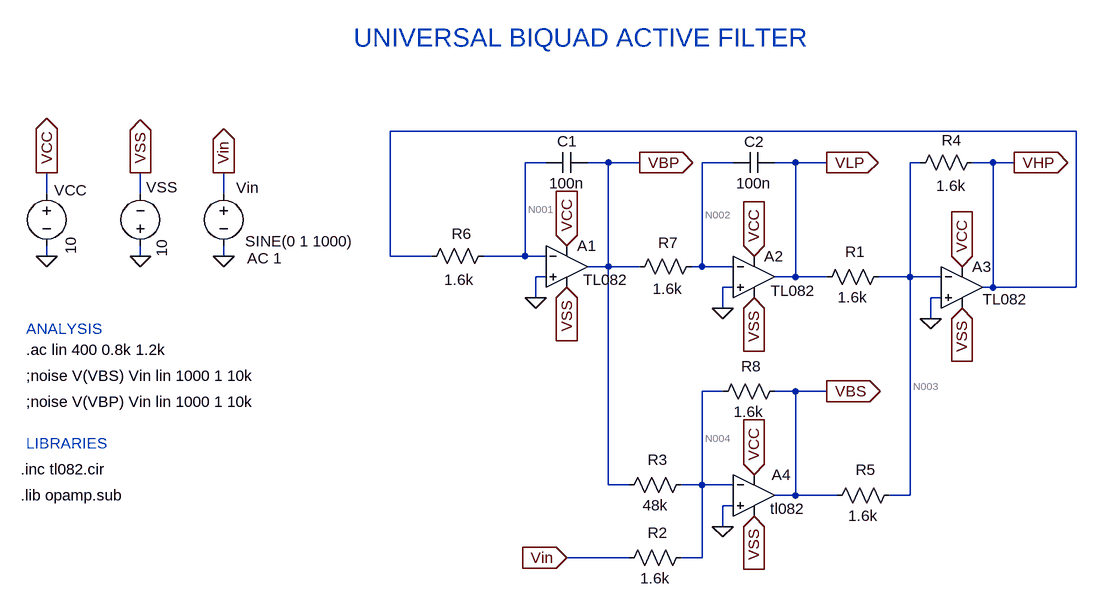
[diagram p0: schematic Universal_Biquad.asc]
Universal_Biquad.asc, the LTspice schematic file:
Version 4
SHEET 1 1496 860
WIRE 1296 -48 240 -48
WIRE 480 0 448 0
WIRE 576 0 544 0
WIRE 624 0 576 0
WIRE 768 0 720 0
WIRE 864 0 832 0
WIRE 912 0 864 0
WIRE 1056 0 1040 0
WIRE 1168 0 1136 0
WIRE 1200 0 1168 0
WIRE -288 48 -288 16
WIRE -144 48 -144 16
WIRE -16 48 -16 16
WIRE -288 144 -288 128
WIRE -144 144 -144 128
WIRE -16 144 -16 128
WIRE 240 144 240 -48
WIRE 304 144 240 144
WIRE 448 144 448 0
WIRE 448 144 384 144
WIRE 480 144 448 144
WIRE 576 160 576 0
WIRE 576 160 544 160
WIRE 624 160 576 160
WIRE 720 160 720 0
WIRE 720 160 704 160
WIRE 768 160 720 160
WIRE 480 176 464 176
WIRE 864 176 864 0
WIRE 864 176 832 176
WIRE 912 176 864 176
WIRE 1040 176 1040 0
WIRE 1040 176 992 176
WIRE 1088 176 1040 176
WIRE 768 192 752 192
WIRE 1168 192 1168 0
WIRE 1168 192 1152 192
WIRE 1296 192 1296 -48
WIRE 1296 192 1168 192
WIRE 464 208 464 176
WIRE 1088 208 1072 208
WIRE 752 224 752 192
WIRE 1072 240 1072 208
WIRE 752 352 720 352
WIRE 864 352 832 352
WIRE 912 352 864 352
WIRE 576 496 576 160
WIRE 608 496 576 496
WIRE 720 496 720 352
WIRE 720 496 688 496
WIRE 768 496 720 496
WIRE 864 512 864 352
WIRE 864 512 832 512
WIRE 928 512 864 512
WIRE 1040 512 1040 176
WIRE 1040 512 1008 512
WIRE 768 528 752 528
WIRE 752 560 752 528
WIRE 608 608 512 608
WIRE 720 608 720 496
WIRE 720 608 688 608
FLAG 464 208 0
FLAG 752 224 0
FLAG -144 144 0
FLAG -288 144 0
FLAG 512 128 VCC
IOPIN 512 128 In
FLAG 512 192 VSS
IOPIN 512 192 In
FLAG 512 608 Vin
IOPIN 512 608 In
FLAG 1200 0 VHP
IOPIN 1200 0 Out
FLAG 624 0 VBP
IOPIN 624 0 Out
FLAG 912 0 VLP
IOPIN 912 0 Out
FLAG -288 16 VCC
IOPIN -288 16 Out
FLAG -144 16 VSS
IOPIN -144 16 Out
FLAG -16 16 Vin
IOPIN -16 16 Out
FLAG -16 144 0
FLAG 800 544 VSS
IOPIN 800 544 In
FLAG 800 480 VCC
IOPIN 800 480 In
FLAG 1072 240 0
FLAG 752 560 0
FLAG 912 352 VBS
IOPIN 912 352 Out
FLAG 800 144 VCC
IOPIN 800 144 In
FLAG 1120 160 VCC
IOPIN 1120 160 In
FLAG 800 208 VSS
IOPIN 800 208 In
FLAG 1120 224 VSS
IOPIN 1120 224 In
SYMBOL res 1152 -16 R90
WINDOW 0 -3 48 VBottom 2
WINDOW 3 36 49 VTop 2
SYMATTR InstName R4
SYMATTR Value 1.6k
SYMBOL res 400 128 R90
WINDOW 0 11 -268 VBottom 2
WINDOW 3 37 54 VTop 2
SYMATTR InstName R7
SYMATTR Value 1.6k
SYMATTR SpiceLine tol=1 pwr=0.1
SYMBOL res 720 144 R90
WINDOW 0 -19 370 VBottom 2
WINDOW 3 35 53 VTop 2
SYMATTR InstName R6
SYMATTR Value 1.6k
SYMBOL res 1024 496 R90
WINDOW 0 -8 52 VBottom 2
WINDOW 3 32 56 VTop 2
SYMATTR InstName R5
SYMATTR Value 1.6k
SYMBOL cap 544 -16 R90
WINDOW 0 -1 31 VBottom 2
WINDOW 3 32 32 VTop 2
SYMATTR InstName C1
SYMATTR Value 100n
SYMBOL cap 832 -16 R90
WINDOW 0 0 32 VBottom 2
WINDOW 3 32 32 VTop 2
SYMATTR InstName C2
SYMATTR Value 100n
SYMBOL voltage -16 32 R0
WINDOW 123 90 115 Right 2
WINDOW 39 0 0 Left 2
WINDOW 0 54 7 Right 2
WINDOW 3 200 89 Right 2
SYMATTR Value2 AC 1
SYMATTR InstName Vin
SYMATTR Value SINE(0 1 1000)
SYMBOL voltage -288 32 R0
WINDOW 0 62 11 Right 2
WINDOW 3 37 82 VRight 2
WINDOW 123 0 0 Left 2
WINDOW 39 0 0 Left 2
SYMATTR InstName VCC
SYMATTR Value 10
SYMBOL voltage -144 144 R180
WINDOW 0 -56 106 Left 2
WINDOW 3 -33 -1 VRight 2
WINDOW 123 0 0 Left 2
WINDOW 39 0 0 Left 2
SYMATTR InstName VSS
SYMATTR Value 10
SYMBOL Opamps\\opamp2 1120 128 R0
WINDOW 3 32 82 Left 2
SYMATTR Value TL082
SYMATTR InstName A3
SYMBOL Opamps\\opamp2 512 96 R0
WINDOW 3 25 84 Left 2
SYMATTR Value TL082
SYMATTR InstName A1
SYMBOL Opamps\\opamp2 800 112 R0
WINDOW 3 26 85 Left 2
SYMATTR Value TL082
SYMATTR InstName A2
SYMBOL Opamps\\opamp2 800 448 R0
WINDOW 3 25 85 Left 2
WINDOW 0 27 32 Left 2
SYMATTR Value tl082
SYMATTR InstName A4
SYMBOL res 704 480 R90
WINDOW 0 -7 52 VBottom 2
WINDOW 3 32 56 VTop 2
SYMATTR InstName R3
SYMATTR Value 48k
SYMBOL res 848 336 R90
WINDOW 0 -7 52 VBottom 2
WINDOW 3 32 56 VTop 2
SYMATTR InstName R8
SYMATTR Value 1.6k
SYMBOL res 1008 160 R90
WINDOW 0 -7 52 VBottom 2
WINDOW 3 32 56 VTop 2
SYMATTR InstName R1
SYMATTR Value 1.6k
SYMBOL res 704 592 R90
WINDOW 0 -7 52 VBottom 2
WINDOW 3 32 56 VTop 2
SYMATTR InstName R2
SYMATTR Value 1.6k
TEXT -320 288 Left 2 !.ac lin 400 0.8k 1.2k
TEXT -328 512 Left 2 !.lib opamp.sub
TEXT -328 472 Left 2 !.inc tl082.cir
TEXT -320 256 Left 2 ;ANALYSIS
TEXT 184 -192 Left 4 ;UNIVERSAL BIQUAD ACTIVE FILTER
TEXT -320 368 Left 2 !;noise V(VBP) Vin lin 1000 1 10k
TEXT -320 328 Left 2 !;noise V(VBS) Vin lin 1000 1 10k
TEXT -320 432 Left 2 ;LIBRARIES

The netlist it stands for:
* Universal_Biquad.asc
R4 VHP N003 1.6k
R7 N001 VHP 1.6k tol=1 pwr=0.1
R6 N002 VBP 1.6k
R5 N003 VBS 1.6k
C1 VBP N001 100n
C2 VLP N002 100n
Vin Vin 0 SINE(0 1 1000) AC 1
VCC VCC 0 10
VSS 0 VSS 10
XA3 0 N003 VCC VSS VHP TL082  ; pins In+ In- V+ V- OUT
XA1 0 N001 VCC VSS VBP TL082  ; pins In+ In- V+ V- OUT
XA2 0 N002 VCC VSS VLP TL082  ; pins In+ In- V+ V- OUT
XA4 0 N004 VCC VSS VBS tl082  ; pins In+ In- V+ V- OUT
R3 N004 VBP 48k
R8 VBS N004 1.6k
R1 N003 VLP 1.6k
R2 N004 Vin 1.6k
.ac lin 400 0.8k 1.2k
.lib opamp.sub
.inc tl082.cir
* ANALYSIS
* UNIVERSAL BIQUAD ACTIVE FILTER
;noise V(VBP) Vin lin 1000 1 10k
;noise V(VBS) Vin lin 1000 1 10k
* LIBRARIES
.backanno
.end

* Results of the author's LTspice run, read from the files saved beside the schematic
* Operating Point, zero values left out:
*   V(vhp) = 11.03 µV
*   V(n003) = 10.97 µV
*   V(n001) = 10.97 µV
*   V(n002) = 10.97 µV
*   V(vbp) = 11.03 µV
*   V(vbs) = 22 µV
*   V(vlp) = -61.81 nV
*   V(vcc) = 10 V
*   V(vss) = -10 V
*   V(n004) = 10.97 µV
*   I(R2) = 6.857 nA
*   I(R1) = 6.895 nA
*   I(R8) = 6.895 nA
*   I(R3) = -1.338 pA
*   I(R5) = -6.895 nA
*   I(R6) = -40.05 pA
*   I(R7) = -40.05 pA
*   I(R4) = 40.05 pA
*   I(Vss) = -38.11 mA
*   I(Vcc) = -38.11 mA
*   I(Vin) = 6.857 nA
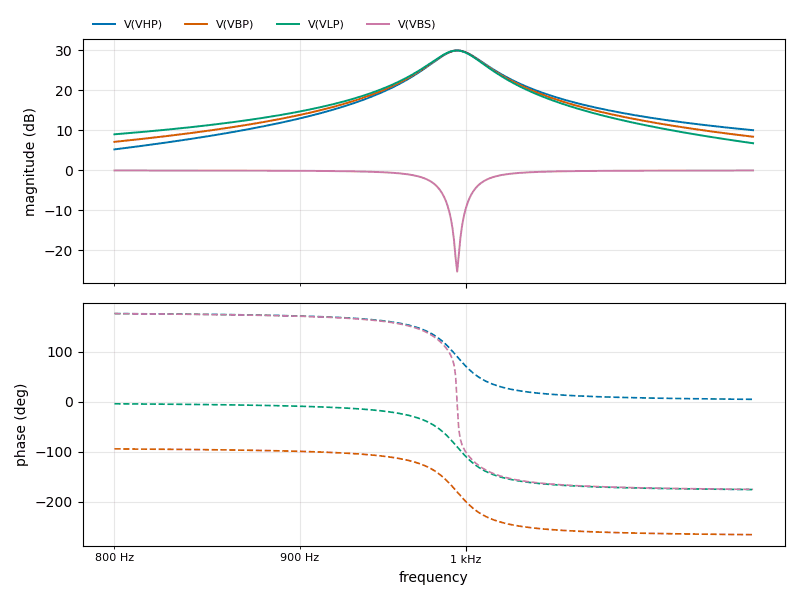
[diagram p1: AC Analysis of Universal_Biquad.asc, plotted from the saved traces]
* AC Analysis, 1 run:
*   V(VHP): 5.25 dB at 800 Hz, 10.05 dB at 1.2 kHz, peak 30.00 dB at 994.5 Hz, 3 dB below the peak at 979.3 Hz and 1.011 kHz
*   V(VBP): 7.14 dB at 800 Hz, 8.42 dB at 1.2 kHz, peak 30.00 dB at 994.5 Hz, 3 dB below the peak at 978.8 Hz and 1.01 kHz
*   V(VLP): 9.03 dB at 800 Hz, 6.79 dB at 1.2 kHz, peak 30.00 dB at 994.5 Hz, 3 dB below the peak at 978.3 Hz and 1.01 kHz
*   V(VBS): -0.02 dB at 800 Hz, -0.03 dB at 1.2 kHz, peak -0.02 dB at 800 Hz, 3 dB below the peak at 978.9 Hz